# EAGLE design Rpi-CAN (EAGLE 6.6.0)
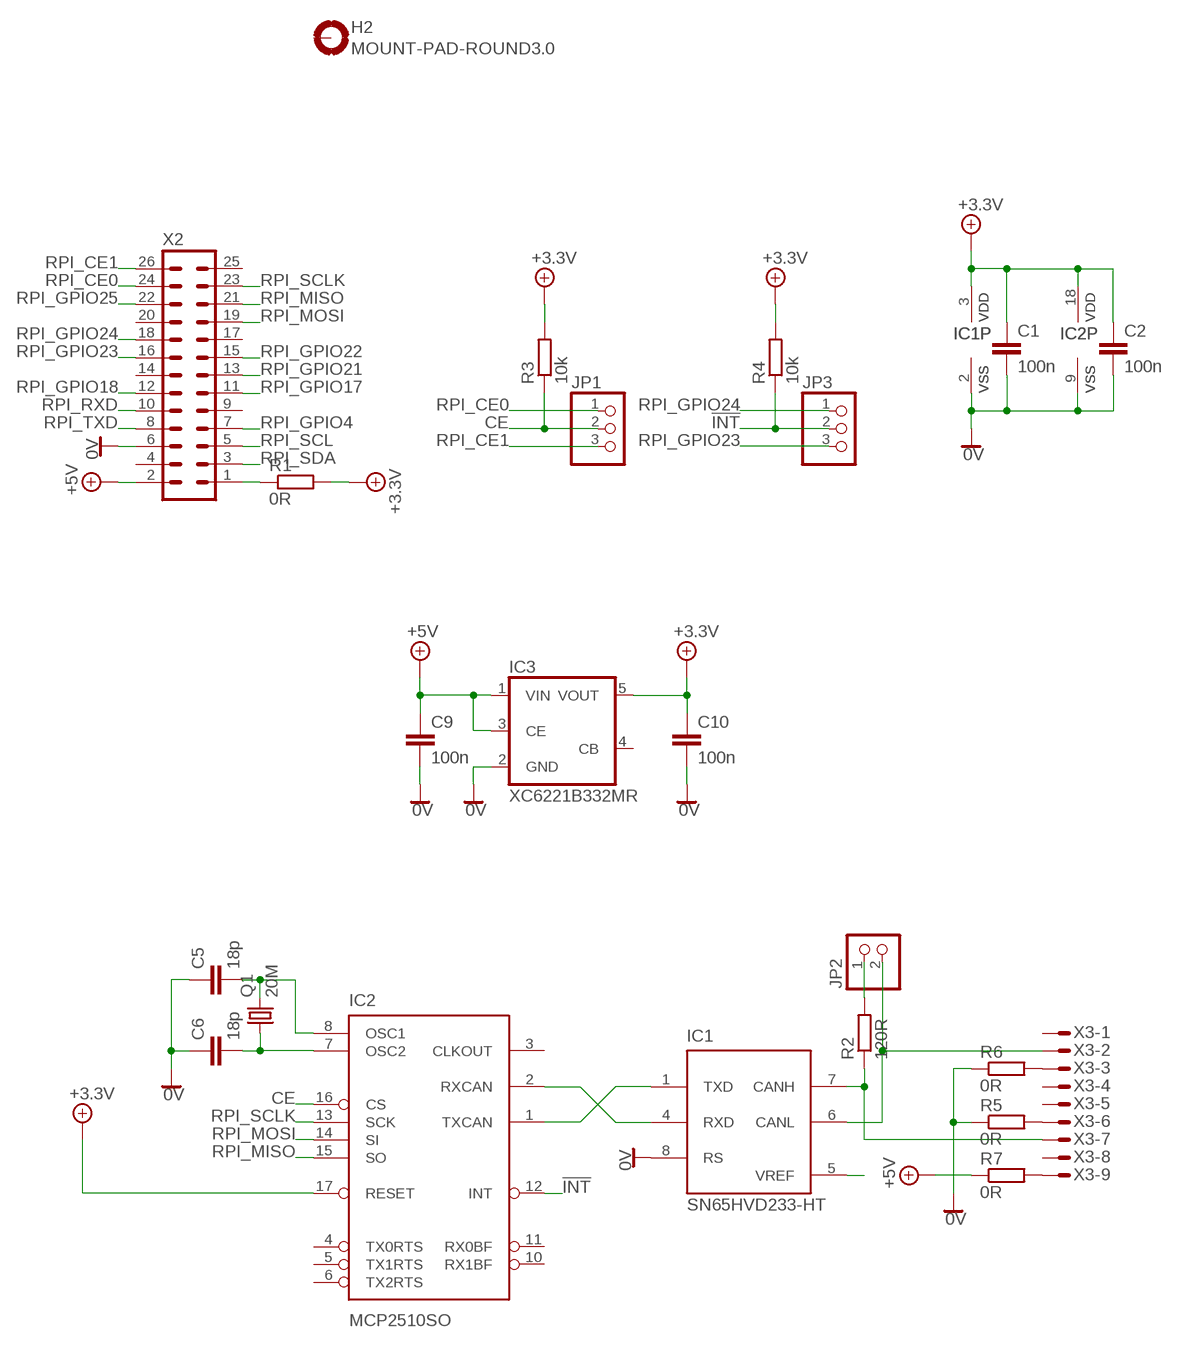
[diagram p0: schematic, sheet 1]

## Parts
C1  100n  C-EUC0805  [C0805]
C2  100n  C-EUC0805  [C0805]
C5  18p  C-EUC0805  [C0805]
C6  18p  C-EUC0805  [C0805]
C9  100n  C-EUC0805  [C0805]
C10  100n  C-EUC0805  [C0805]
H2  MOUNT-PAD-ROUND3.0  [3,0-PAD]
IC1  SN65HVD233-HT  MCP2551SN  [SO-08]
IC2  MCP2510SO  [SO-18W]
IC3  XC6221B332MR  TS520533  [SOT25]
JP1  PINHD-1X3  [1X03]
JP2  PINHD-1X2  [1X02]
JP3  PINHD-1X3  [1X03]
Q1  20M  CRYSTALSM49  [SM49]
R1  0R  R-EU_R0805  [R0805]
R2  120R  R-EU_R0805  [R0805]
R3  10k  R-EU_R0805  [R0805]
R4  10k  R-EU_R0805  [R0805]
R5  0R  R-EU_R0805  [R0805]
R6  0R  R-EU_R0805  [R0805]
R7  0R  R-EU_R0805  [R0805]
X2  MA13-2  [MA13-2]
X3  M09DS  [M09D]

## Nets
0V: C1.2 C2.2 C5.1 C6.1 C9.2 C10.2 IC1.2(VSS) IC1.8(RS) IC2.9(VSS) IC3.2(GND) R5.1 R6.1 X2.6
!INT: IC2.12(INT) JP3.2 R4.1
+3.3V: C1.1 C2.1 C10.1 IC1.3(VDD) IC2.17(RESET) IC2.18(VDD) IC3.5(VOUT) R1.2 R3.2 R4.2
+5V: C9.1 IC3.1(VIN) IC3.3(CE) R7.1 X2.2
CE: IC2.16(CS) JP1.2 R3.1
N$1: IC1.6(CANL) JP2.2 X3.2
N$2: R5.2 X3.6
N$3: IC1.7(CANH) R2.1 X3.7
N$4: R6.2 X3.3
N$5: R7.2 X3.9
N$8: IC1.4(RXD) IC2.2(RXCAN)
N$9: IC1.1(TXD) IC2.1(TXCAN)
N$10: C5.2 IC2.8(OSC1) Q1.2
N$11: C6.2 IC2.7(OSC2) Q1.1
N$12: JP2.1 R2.2
N$16: R1.1 X2.1
N$17: IC1.5(VREF)
RPI_CE0: JP1.1 X2.24
RPI_CE1: JP1.3 X2.26
RPI_GPIO4: X2.7
RPI_GPIO17: X2.11
RPI_GPIO18: X2.12
RPI_GPIO21: X2.13
RPI_GPIO22: X2.15
RPI_GPIO23: JP3.3 X2.16
RPI_GPIO24: JP3.1 X2.18
RPI_GPIO25: X2.22
RPI_MISO: IC2.15(SO) X2.21
RPI_MOSI: IC2.14(SI) X2.19
RPI_RXD: X2.10
RPI_SCL: X2.5
RPI_SCLK: IC2.13(SCK) X2.23
RPI_SDA: X2.3
RPI_TXD: X2.8
Unconnected: H2.B3,0(MOUNT) IC2.3(CLKOUT) IC2.4(TX0RTS) IC2.5(TX1RTS) IC2.6(TX2RTS) IC2.10(RX1BF) IC2.11(RX0BF) IC3.4(CB) X2.4 X2.9 X2.14 X2.17 X2.20 X2.25 X3.1 X3.4 X3.5 X3.8

## Library data of the parts
C1 C2 C5 C6 C9 C10 = rcl:C-EU: CAPACITOR, European symbol
H2 = holes:MOUNT-PAD-ROUND: MOUNTING PAD, round
IC1 = microchip_can:MCP2551: High Speed CAN tranceiver
IC2 = microchip_can:MCP2510
IC3 = v-reg:TS5205: 150mA Low Noise LDO Voltage Regulator with Enable TSC [Taiwan Semiconductor Company, Ltd] Source: http://www.taiwansemi.com .. 5205_0409c.pdf
JP1 JP3 = pinhead:PINHD-1X3: PIN HEADER
JP2 = pinhead:PINHD-1X2: PIN HEADER
Q1 = crystal:CRYSTAL: CRYSTAL; OC_FARNELL: unknown; OC_NEWARK: unknown
R1-R7 = rcl:R-EU_: RESISTOR, European symbol
X2 = con-lstb:MA13-2: PIN HEADER; OC_FARNELL: unknown; OC_NEWARK: unknown
X3 = con-subd:M09?S: SUB-D; OC_FARNELL: unknown; OC_NEWARK: unknown

## Board
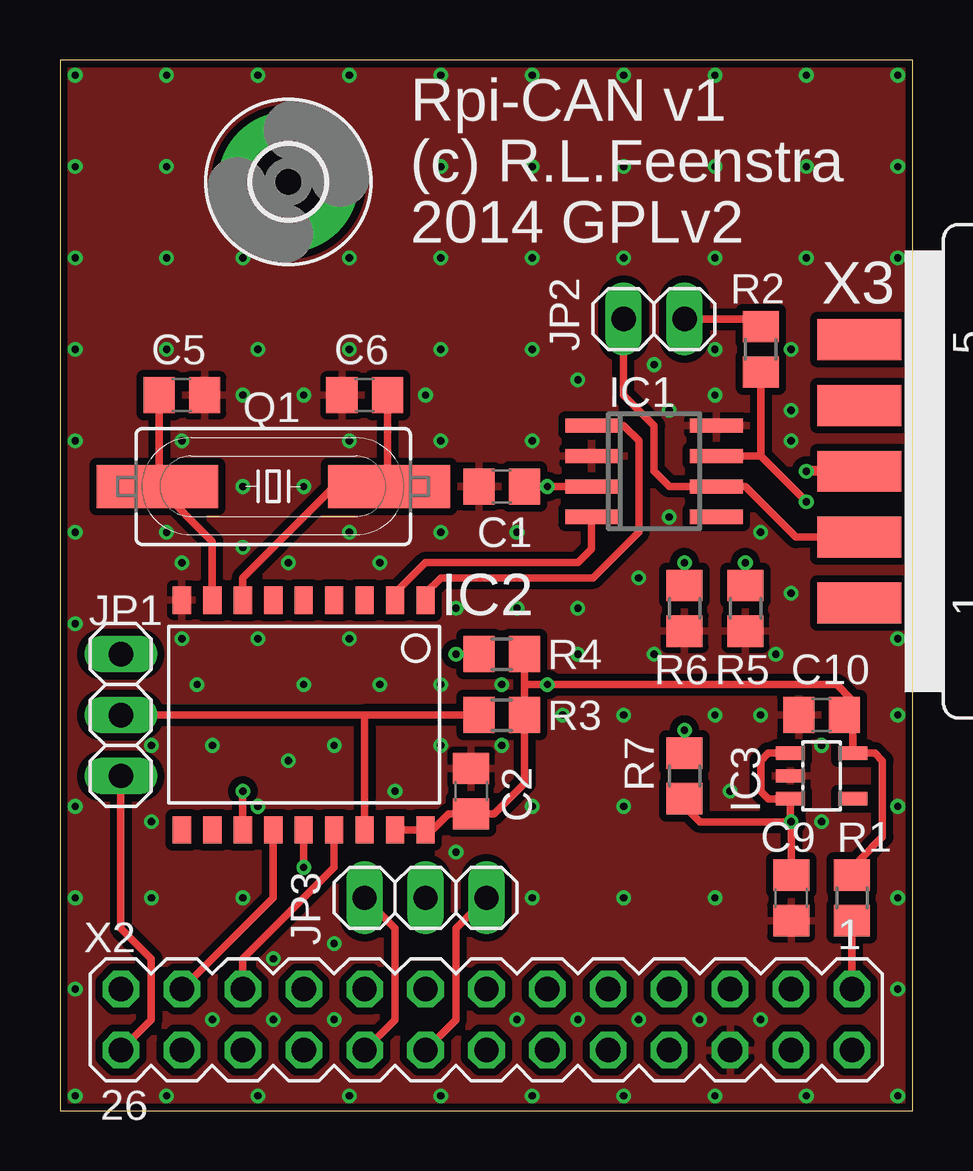
[diagram p1: board, top side]
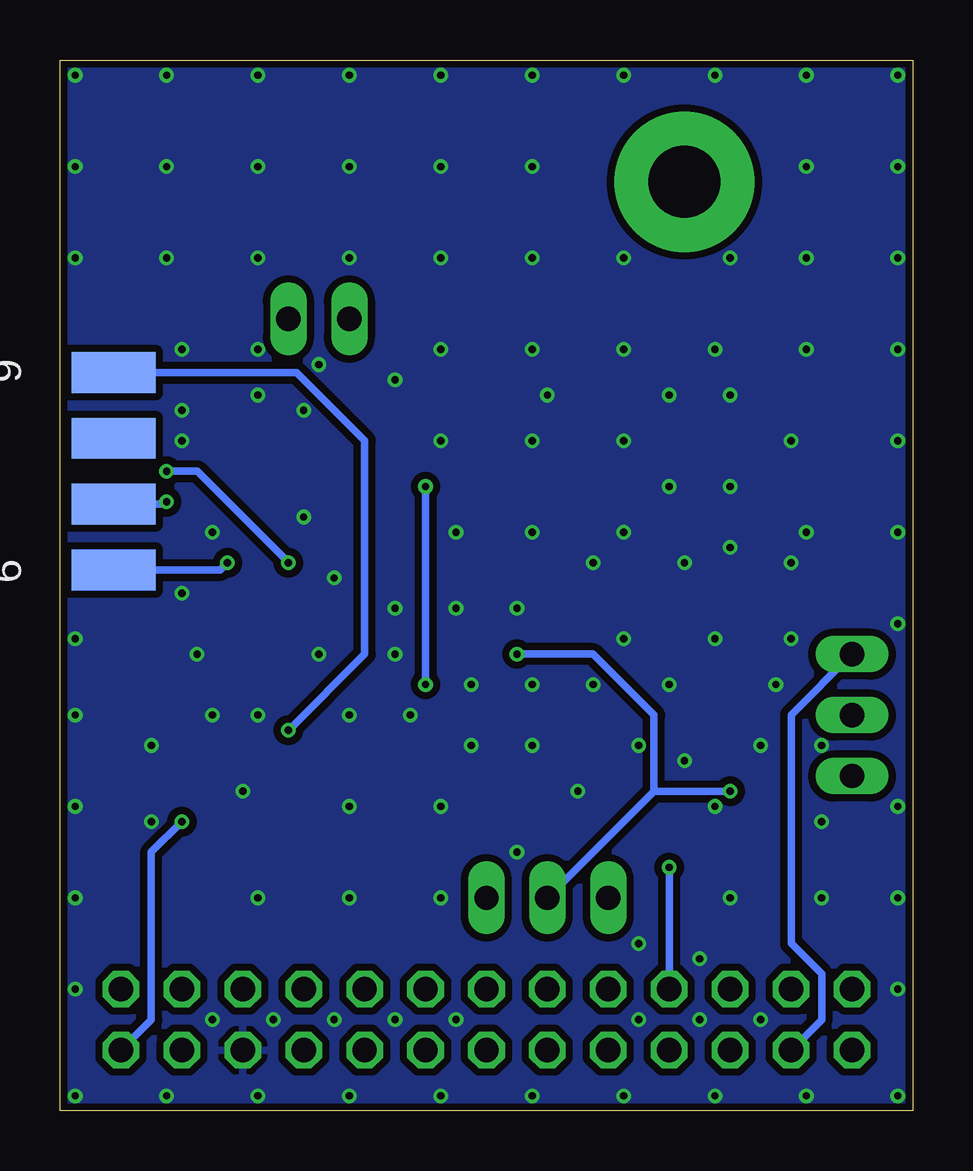
[diagram p2: board, bottom side, seen from below]

Size 35.56 x 43.8 mm. Coordinates in mm from the lower left corner, seen from the top.
Outline: 35.56,43.8 0,43.8 0,0 35.56,0 35.56,43.8
Copper layers (1*16): Top 0.035mm / dielectric 1.5mm / Bottom 0.035mm
Design rules "Elecrow_2-layer_eagle_rule": minimum track width 6mil, minimum drill 12mil, track to track 6mil, track to pad 6mil, pad to pad 6mil, via to via 6mil, smd to smd 0mil, copper to edge 10mil, drill to drill 10mil, minimum pad ring 10mil, minimum via ring 6mil, stop-mask expansion 2mil, vias tented up to drill 100mil, thermal gap 10mil

### Footprints (pad centres in the part's own frame; a part is rotated, then mirrored left to right if it is on the bottom)
C0805 = smd 1.3 x 1.5: 1 -0.95,0; 2 0.95,0
3,0-PAD = drill 3 pad 5.842: B3,0 0,0
SO-08 = smd 0.6 x 2.2: 1 -1.905,-2.6; 2 -0.635,-2.6; 3 0.635,-2.6; 4 1.905,-2.6; 5 1.905,2.6; 6 0.635,2.6; 7 -0.635,2.6; 8 -1.905,2.6
SO-18W = smd 0.762 x 1.143: 1 -5.08,-4.788; 2 -3.81,-4.788; 3 -2.54,-4.788; 4 -1.27,-4.788; 5 0,-4.788; 6 1.27,-4.788; 7 2.54,-4.788; 8 3.81,-4.788; 9 5.08,-4.788; 10 5.08,4.788; 11 3.81,4.788; 12 2.54,4.788; 13 1.27,4.788; 14 0,4.788; 15 -1.27,4.788; 16 -2.54,4.788; 17 -3.81,4.788; 18 -5.08,4.788
SOT25 = smd 0.55 x 1.2: 1 -0.95,-1.3; 2 0,-1.3; 3 0.95,-1.3; 4 0.95,1.3; 5 -0.95,1.3
1X03 = drill 1.016 long: 1 -2.54,0; 2 0,0; 3 2.54,0
1X02 = drill 1.016 long: 1 -1.27,0; 2 1.27,0
SM49 = smd 5.08 x 1.778: 1 -4.826,0; 2 4.826,0
R0805 = smd 1.3 x 1.5: 1 -0.95,0; 2 0.95,0
MA13-2 = drill 1.016 octagon: 1 -15.24,-1.27; 2 -15.24,1.27; 3 -12.7,-1.27; 4 -12.7,1.27; 5 -10.16,-1.27; 6 -10.16,1.27; 7 -7.62,-1.27; 8 -7.62,1.27; 9 -5.08,-1.27; 10 -5.08,1.27; 11 -2.54,-1.27; 12 -2.54,1.27; 13 0,-1.27; 14 0,1.27; 15 2.54,-1.27; 16 2.54,1.27; 17 5.08,-1.27; 18 5.08,1.27; 19 7.62,-1.27; 20 7.62,1.27; 21 10.16,-1.27; 22 10.16,1.27; 23 12.7,-1.27; 24 12.7,1.27; 25 15.24,-1.27; 26 15.24,1.27
M09D = smd 1.7 x 3.5: 1 5.486,-6.045; 2 2.743,-6.045; 3 0,-6.045; 4 -2.743,-6.045; 5 -5.486,-6.045 | smd 1.7 x 3.5 bottom: 6 4.115,-6.045; 7 1.372,-6.045; 8 -1.372,-6.045; 9 -4.115,-6.045

### Placement (x,y rotation side)
C1  18.41,26.02 180 top
C2  17.14,13.33 90 top
C5  5.08,29.83 180 top
C6  12.7,29.83 0 top
C9  30.48,8.88 270 top
C10  31.75,16.5 180 top
H2  9.53,38.73 180 top
IC1  24.77,26.66 270 top
IC2  10.16,16.5 180 top
IC3  31.75,13.96 270 top
JP1  2.54,16.5 270 top
JP2  24.77,33.01 180 top
JP3  15.24,8.88 0 top
Q1  8.89,26.02 180 top
R1  33.02,8.88 90 top
R2  29.21,31.74 90 top
R3  18.41,16.5 0 top
R4  18.41,19.04 0 top
R5  28.57,20.94 90 top
R6  26.04,20.94 90 top
R7  26.04,13.96 90 top
X2  17.78,3.8 180 top
X3  39.37,26.66 270 top

### Tracks (layer width: path | path; a pad name or v marks a point on that pad's centre or on a via)
0V  (via drill 0.3)
  other vias: 20.95,16.5 29.21,16.5 21.59,19.04 29.84,19.04 16.51,20.94 21.59,20.94 25.4,24.75 9.53,14.6 24.77,19.04 29.21,24.12 30.48,27.93 24.77,31.1 27.3,29.83 21.59,30.47 19.68,27.93 9.53,22.85 13.34,22.85 7.62,23.48 7.62,26.02 10.16,26.02 5.08,27.93 7.62,29.83 10.16,29.83 15.24,29.83 4.45,24.12 5.08,22.85 0.64,27.93 0.64,31.74 0.64,43.17 0.64,39.36 4.45,39.36 4.45,43.17 0.64,35.55 4.45,31.74 4.45,35.55 7.62,35.55 12.06,31.74 12.06,35.55 8.26,31.74 8.26,43.17 12.06,43.17 15.88,31.74 15.88,43.17 15.88,39.36 19.68,39.36 19.68,43.17 15.88,35.55 19.68,31.74 19.68,35.55 23.5,43.17 23.5,39.36 27.3,39.36 27.3,43.17 23.5,35.55 27.3,31.74 27.3,35.55 31.11,43.17 31.11,39.36 34.92,39.36 34.92,43.17 31.11,35.55 34.92,35.55 8.26,0.62 4.45,0.62 0.64,0.62 0.64,5.07 6.35,3.8 3.81,8.88 0.64,8.88 8.89,3.8 7.62,8.88 0.64,12.69 3.81,12.05 3.81,15.23 5.71,17.77 8.26,12.69 6.35,15.23 0.64,20.31 5.08,19.67 0.64,24.12 8.26,19.67 13.34,17.77 15.88,17.77 12.06,19.67 13.97,13.33 15.88,15.23 19.05,20.94 11.43,15.23 19.68,12.69 23.5,16.5 27.3,16.5 23.5,12.69 27.94,13.33 34.92,16.5 34.92,19.67 31.75,15.23 34.92,12.69 12.06,0.62 11.43,3.8 11.43,6.98 16.51,10.79 19.05,3.8 21.59,3.8 19.68,8.88 15.88,0.62 19.68,0.62 23.5,8.88 24.13,3.8 26.67,3.8 27.3,8.88 23.5,0.62 27.3,0.62 31.75,12.05 29.21,3.8 34.92,5.07 34.92,8.88 31.11,0.62 34.92,0.62 12.06,24.12 12.06,27.93 15.88,27.93 15.88,24.12 19.05,24.12 25.4,29.2 24.13,22.21 30.48,31.74 30.48,29.2 30.48,21.58 8.89,6.34 10.16,17.77 18.41,17.77 18.41,15.23
  pour Top (isolate 0.305): 35.56,-0.01 0,-0.01 0,43.8 35.56,43.8
  pour Bottom (isolate 0.305): 35.56,-0.01 0,-0.01 0,43.8 35.56,43.8
!INT  (via drill 0.3)
  Top 0.305: v7.62,13.33 IC2.12 | v16.51,19.04 R4.1
  Bottom 0.305: JP3.2 10.79,13.33 | 10.79,13.33 v7.62,13.33 | 10.79,13.33 10.79,16.5 13.34,19.04 v16.51,19.04
+3.3V  (via drill 0.3)
  Top 0.305: IC2.17 IC2.18 15.53,11.71 16.2,12.38 C2.1 18.1,12.38 19.36,13.64 R3.2 19.36,17.77 | R1.2 33.34,10.46 34.29,11.42 34.29,14.6 33.98,14.91 IC3.5 33.05,16.15 C10.1 33.02,16.82 33.02,17.13 32.38,17.77 v20.32,17.77 19.36,17.77 | IC1.3 v20.32,26.02 C1.1 | 19.36,17.77 R4.2
  Bottom 0.305: v20.32,26.02 v20.32,17.77
+5V  (via drill 0.3)
  Top 0.305: v30.48,12.05 C9.1 | v30.48,12.05 30.45,12.09 IC3.3 29.52,13.01 29.21,13.33 29.21,14.6 29.52,14.91 IC3.1 | R7.1 26.04,12.69 26.67,12.05 v30.48,12.05
  Bottom 0.305: X2.2 31.75,3.8 31.75,10.79 v30.48,12.05
CE
  Top 0.305: JP1.2 12.7,16.5 | 12.7,16.5 IC2.16 | R3.1 12.7,16.5
N$1
  Top 0.305: X3.2 30.68,23.92 28.57,26.02 IC1.6 25.4,26.02 24.77,26.66 24.77,28.56 23.5,29.83 JP2.2
N$2  (via drill 0.3)
  Top 0.305: v28.57,22.85 R5.2
  Bottom 0.305: X3.6 28.88,22.54 v28.57,22.85
N$3  (via drill 0.3)
  Top 0.305: R2.1 29.21,27.29 | 29.21,27.29 IC1.7 | v31.11,25.39 29.21,27.29
  Bottom 0.305: X3.7 31.22,25.29 v31.11,25.39
N$4  (via drill 0.3)
  Top 0.305: v26.04,22.85 R6.2
  Top 0.406: X3.3 v31.11,26.66
  Bottom 0.305: v31.11,26.66 29.84,26.66 v26.04,22.85
N$5  (via drill 0.3)
  Top 0.305: R7.2 v26.04,15.87
  Bottom 0.305: v26.04,15.87 22.86,19.04 22.86,27.93 25.7,30.77 X3.9
N$8
  Top 0.305: IC2.2 13.97,21.58 15.24,22.85 21.59,22.85 22.16,23.42 IC1.4
N$9
  Top 0.305: IC1.1 23.5,28.56 24.13,27.93 24.13,24.12 22.23,22.21 15.88,22.21 15.24,21.58 IC2.1
N$10
  Top 0.305: C5.2 4.13,26.09 Q1.2 6.35,23.74 IC2.8
N$11
  Top 0.305: IC2.7 7.62,22.21 11.43,26.02 Q1.1 13.65,26.09 C6.2
N$12
  Top 0.305: JP2.1 28.89,33.01 R2.2
N$16
  Top 0.305: R1.1 X2.1
RPI_CE0
  Bottom 0.305: X2.24 3.81,3.8 3.81,5.71 5.08,6.98 5.08,16.5 JP1.1
RPI_CE1
  Top 0.305: JP1.3 2.54,7.61 3.81,6.34 3.81,3.8 X2.26
RPI_GPIO23
  Top 0.305: X2.16 16.51,3.8 16.51,7.61 JP3.3
RPI_GPIO24
  Top 0.305: X2.18 13.97,3.8 13.97,7.61 JP3.1
RPI_MISO
  Top 0.305: IC2.15 11.43,10.15 7.62,6.34 X2.21
RPI_MOSI  (via drill 0.3)
  Top 0.305: v10.16,10.15 IC2.14
  Bottom 0.305: X2.19 v10.16,10.15
RPI_SCLK
  Top 0.305: X2.23 8.89,8.88 IC2.13

### Text on the board
tNames: Rpi-CAN v1 | (c) R.L.Feenstra | 2014 GPLv2